# EAGLE design 405_led_single_jetracer (EAGLE 9.6.2)
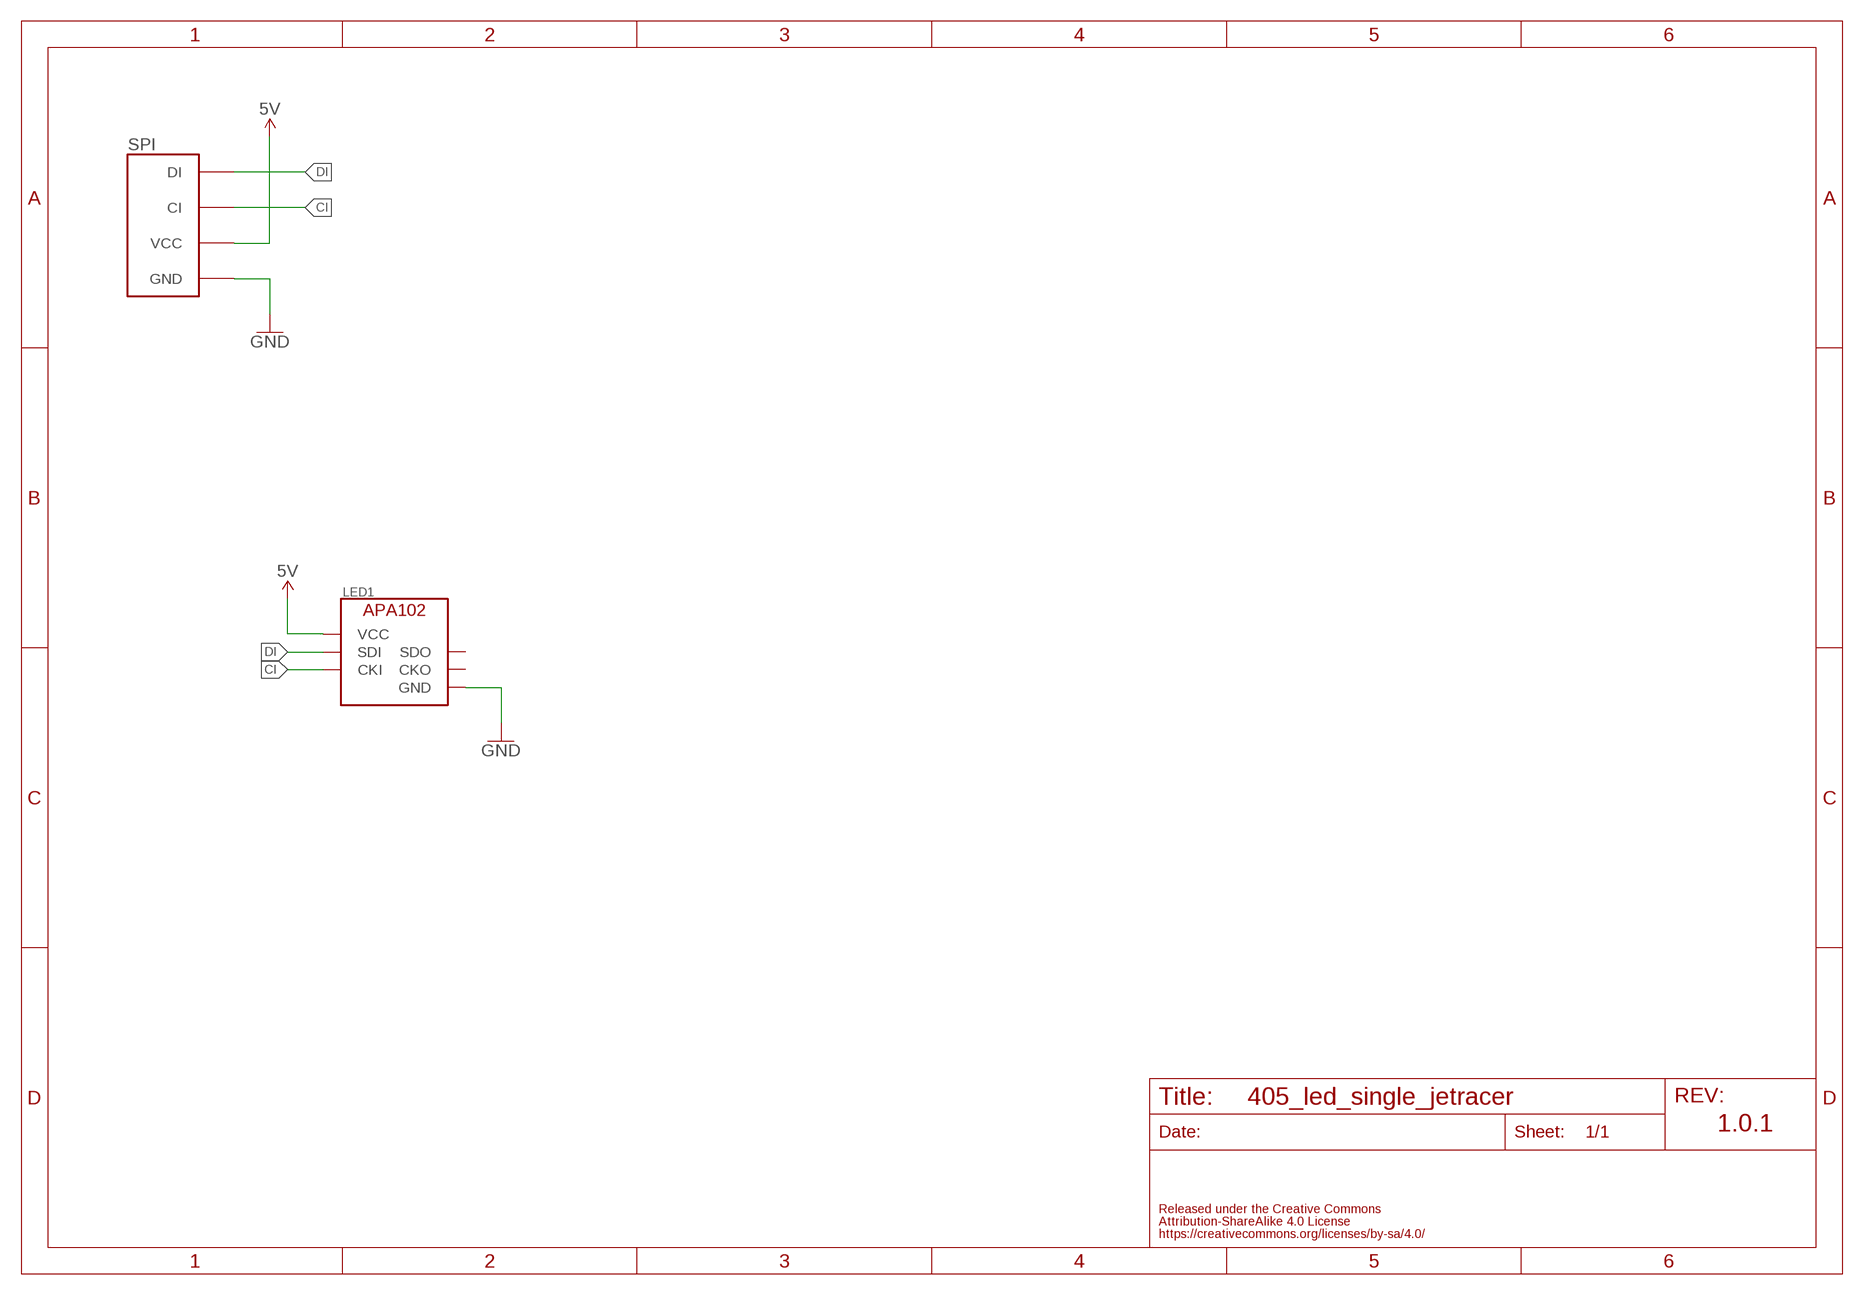
[diagram p0: schematic, sheet 1]

## Parts
LED1  APA102_IPIXEL  [APA102_2020]
SPI  FABO-SPI-LED-B04B  [SPI-B04B-PASK-1]

## Nets
5V: LED1.VCC SPI.VCC
CI: LED1.CKI SPI.CI
DI: LED1.SDI SPI.DI
GND: LED1.GND SPI.GND
Unconnected: LED1.CKO LED1.SDO

## Notes on the sheet
- 1.0.1

## Library data of the parts
LED1 = FaBo-LED:APA102
SPI = FaBo-Connetor:FABO-SPI-LED

## Board
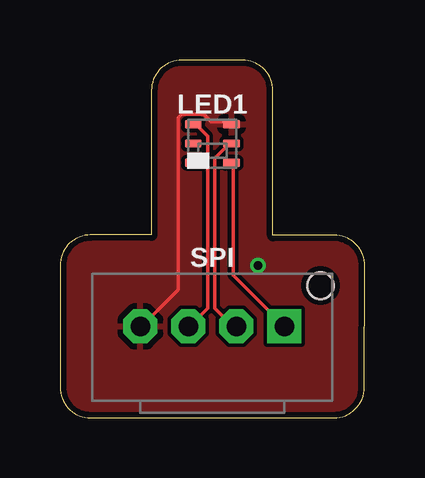
[diagram p1: board, top side]
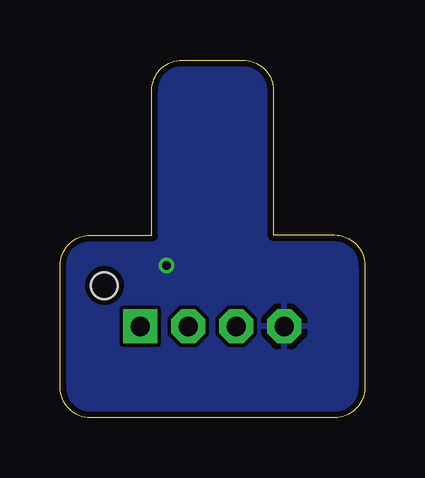
[diagram p2: board, bottom side, seen from below]

Size 12.7 x 14.91 mm. Coordinates in mm from the lower left corner, seen from the top.
Outline: 0,6.35 0,1.27 arc90 1.27,0 11.41,0 arc90 12.68,1.27 12.7,6.34 arc90 11.42,7.61 8.87,7.6 8.87,13.64 arc90 7.6,14.91 5.08,14.91 arc90 3.81,13.64 3.81,7.62 1.27,7.62 arc90 0,6.35
Copper layers (1*16): Top 0.035mm / dielectric 1.5mm / Bottom 0.035mm
Design rules "SeeedStudio_2layer_DRU_no_angle_20140221": minimum track width 6mil, minimum drill 12mil, track to track 6mil, track to pad 6mil, pad to pad 6mil, via to via 6mil, smd to smd 0mil, copper to edge 10mil, drill to drill 10mil, minimum pad ring 10mil, minimum via ring 6mil, stop-mask expansion 2mil, vias tented up to drill 100mil, thermal gap 10mil

### Footprints (pad centres in the part's own frame; a part is rotated, then mirrored left to right if it is on the bottom)
APA102_2020 = smd 0.7 x 0.35: CKI 0.8,0; CKO -0.8,0; GND 0.8,0.8; SDI 0.8,-0.8; SDO -0.8,-0.8; VCC -0.8,0.8
SPI-B04B-PASK-1 = drill 0.8 pad 1.422 octagon: CI 1,1.27; GND -3,1.27; VCC -1,1.27 | drill 0.8 pad 1.422 square: DI 3,1.27 | hole 1.1: 4.5,2.97

### Placement (x,y rotation side)
LED1  6.35,11.43 0 top
SPI  6.35,2.54 0 top

### Tracks (layer width: path | path; a pad name or v marks a point on that pad's centre or on a via)
5V
  Top 0.152: LED1.VCC 5.69,12.19 6.15,11.73 6.15,4.57 5.38,3.81 SPI.VCC
CI
  Top 0.152: LED1.CKI 7.06,11.43 6.45,10.82 6.45,4.57 7.21,3.81 SPI.CI
DI
  Top 0.152: LED1.SDI 7.21,10.52 7.21,5.94 SPI.DI
GND  (via drill 0.35)
  Top 0.152: LED1.GND 7.06,12.34 6.3,12.34 5.99,12.65 5.08,12.65 4.93,12.5 4.93,5.33 3.4,3.81 SPI.GND
  other vias: 8.25,6.35
  pour Top: -0.64,-0.64 13.97,-0.64 13.97,15.24 -0.64,15.24
  pour Bottom: -0.64,-0.64 13.97,-0.64 13.97,15.24 -0.64,15.24